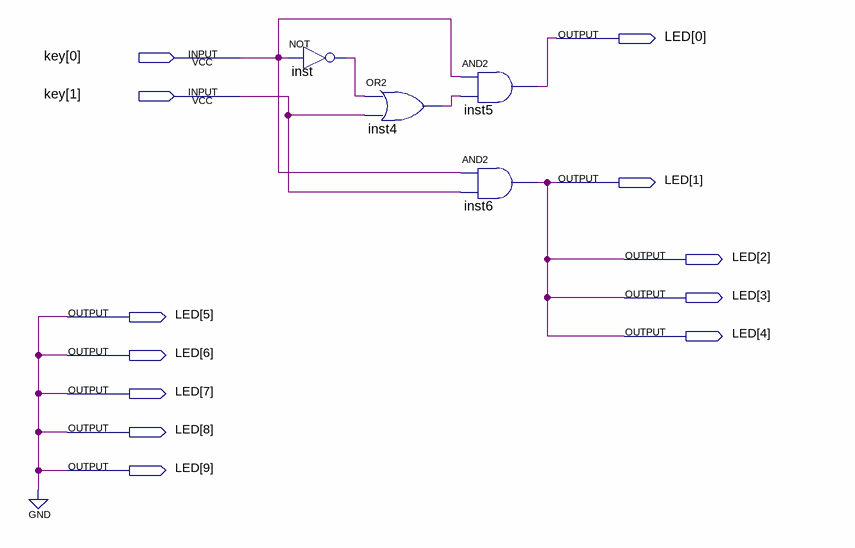
[diagram p0: schematic sheet]
// Quartus schematic ROMANOVA_01.bdf as structural Verilog: 4 symbols, 12 pins
module ROMANOVA_01 (
  input  [1:0] key,
  output [9:0] LED
);

  wire inst4_out, inst_out;

  not inst (inst_out, key[0]);
  or inst4 (inst4_out, inst_out, key[1]);
  and inst5 (LED[0], key[0], inst4_out);
  and inst6 (LED[4], key[0], key[1]);

  assign {LED[9:5], LED[3:1]} = {{5{1'b0}}, {3{LED[4]}}};
endmodule
